# EAGLE design tomu-eagle0 (EAGLE 8.7.1)
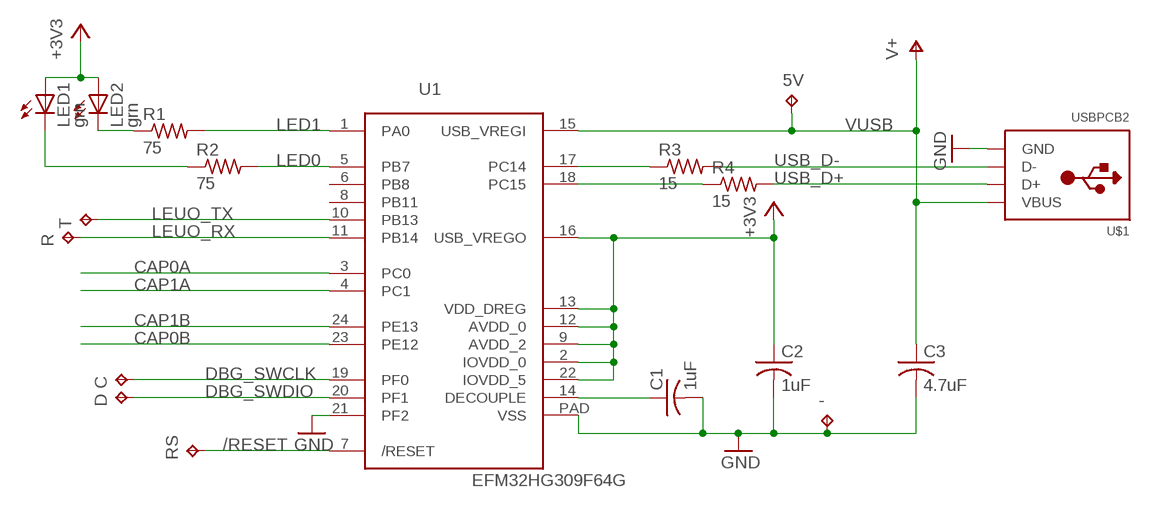
[diagram p0: schematic, sheet 1]

## Parts
5V  TPTP10R  [TP10R]
-  TPTP10SQ  [TP10SQ]
C  TPTP10R  [TP10R]
C1  1uF  C-USC0402K  [C0402K]
C2  1uF  C-USC0402K  [C0402K]
C3  4.7uF  C-USC0402K  [C0402K]
D  TPTP10R  [TP10R]
LED1  grn  LEDCHIP-LED0603  [CHIP-LED0603]
LED2  grn  LEDCHIP-LED0603  [CHIP-LED0603]
R  TPTP10R  [TP10R]
R1  75  R-US_R0402  [R0402]
R2  75  R-US_R0402  [R0402]
R3  15  R-US_R0402  [R0402]
R4  15  R-US_R0402  [R0402]
RS  TPTP10R  [TP10R]
T  TPTP10R  [TP10R]
U1  EFM32HG309F64G  [QFN24PAD]
U$1  USBPCB2  [USB-A-PCB-2]

## Nets
+3V3: C2.1 LED1.A LED2.A U1.2(IOVDD_0) U1.9(AVDD_2) U1.12(AVDD_0) U1.13(VDD_DREG) U1.16(USB_VREGO) U1.22(IOVDD_5)
/RESET: RS.TP U1.7(/RESET)
CAP0A: U1.3(PC0)
CAP0B: U1.23(PE12)
CAP1A: U1.4(PC1)
CAP1B: U1.24(PE13)
DBG_SWCLK: C.TP U1.19(PF0)
DBG_SWDIO: D.TP U1.20(PF1)
DECOUPLE: C1.1 U1.14(DECOUPLE)
GND: -.TP C1.2 C2.2 C3.2 U1.21(PF2) U1.PAD(VSS) U$1.GND
LED0: R2.2 U1.5(PB7)
LED1: R1.2 U1.1(PA0)
LEUO_RX: R.TP U1.11(PB14)
LEUO_TX: T.TP U1.10(PB13)
N$4: LED1.C R2.1
N$5: LED2.C R1.1
RUSB_D+: R4.1 U1.18(PC15)
RUSB_D-: R3.1 U1.17(PC14)
USB_D+: R4.2 U$1.USB_P(D+)
USB_D-: R3.2 U$1.USB_M(D-)
VUSB: 5V.TP C3.1 U1.15(USB_VREGI) U$1.5V(VBUS) ; supply symbol labelled V+
Unconnected: U1.6(PB8) U1.8(PB11)

## Library data of the parts
5V - C D R RS T = testpad:TP: Test pad
C1-C3 = adafruit:C-US: CAPACITOR, American symbol
LED1 LED2 = adafruit:LED: LED OSRAM: - CHIPLED LG R971, LG N971, LY N971, LG Q971, LY Q971, LO R971, LY R971 LH N974, LH R974 LS Q976, LO Q976, LY Q976 LO Q996 - Hyper CHIPLED LW Q18S LB Q993, LB Q99A, LB R99A - SideLED LS A670, LO A670, LY A670, LG A670, LP A670 LB A673, LV A673, LT A673, LW A673 LH A674 LY A675 LS A676, LA A676, LO A676, LY A676, LW A676 LS A679, LY A679, LG A679 - Hyper Micro SIDELED® LS Y876, LA Y876, LO Y876, LY Y876 LT Y87S - SmartLED LW L88C, LW L88S LB L89C, LB L89S, LG L890 LS L89K, LO L89K, LY L89K LS L896, LA L896, LO L896, LY L896 - TOPLED LS T670, LO T670, LY T670, LG T670, LP T670 LSG T670, LSP T670, LSY T670, LOP T670, LYG T670 LG T671, LOG T671, LSG T671 LB T673, LV T673, LT T673, LW T673 LH T674 LS T676, LA T676, LO T676, LY T676, LB T676, LH T676, LSB T676, LW T676 LB T67C, LV T67C, LT T67C, LS T67K, LO T67K, LY T67K, LW E67C LS E67B, LA E67B, LO E67B, LY E67B, LB E67C, LV E67C, LT E67C LW T67C LS T679, LY T679, LG T679 LS T770, LO T770, LY T770, LG T770, LP T770 LB T773, LV T773, LT T773, LW T773 LH T774 LS E675, LA E675, LY E675, LS T675 LS T776, LA T776, LO T776, LY T776, LB T776 LHGB T686 LT T68C, LB T68C - Hyper Mini TOPLED® LB M676 - Mini TOPLED Santana® LG M470 LS M47K, LO M47K, LY M47K Source: http://www.osram.convergy.de/
R1-R4 = adafruit:R-US_: RESISTOR, American symbol
U1 = todstuff:EFM32HG309F64G
U$1 = todstuff:USB

## Board
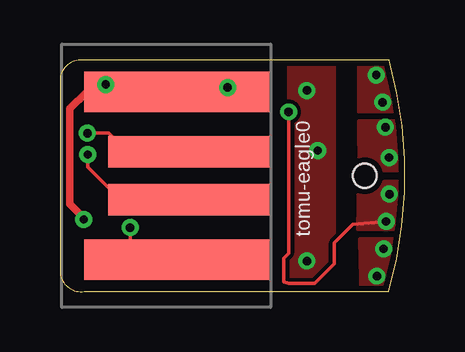
[diagram p1: board, top side]
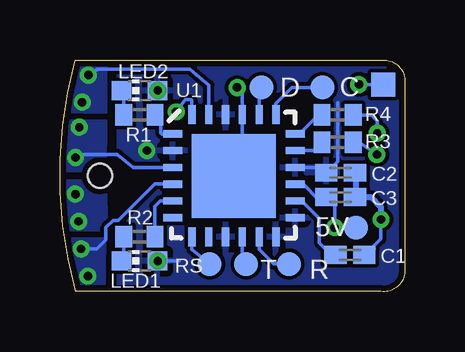
[diagram p2: board, bottom side, seen from below]

Size 14.36 x 9.67 mm. Coordinates in mm from the lower left corner, seen from the top.
Outline: 0,8.91 0,0.75 arc90 1,0.01 13.7,0.01 arc32 13.72,9.66 1,9.66 arc90 0,8.91
Copper layers (1*16): Top 0.0356mm / dielectric 1.5011mm / Bottom 0.0356mm
Design rules "LaenPCBOrderTodTent *": minimum track width 6mil, minimum drill 13mil, track to track 6mil, track to pad 6mil, pad to pad 6mil, via to via 6mil, smd to smd 6mil, copper to edge 10mil, drill to drill 6mil, minimum pad ring 7mil, minimum via ring 7mil, stop-mask expansion 3mil, vias tented up to drill 20mil, thermal gap 10mil
Holes 1 mm at 12.7,4.83

### Footprints (pad centres in the part's own frame; a part is rotated, then mirrored left to right if it is on the bottom)
TP10R = smd 1 x 1: TP 0,0
TP10SQ = smd 1 x 1: TP 0,0
C0402K = smd 0.925 x 0.74: 1 -0.6,0; 2 0.6,0
CHIP-LED0603 = smd 0.8 x 0.8: A 0,-0.75; C 0,0.75
R0402 = smd 0.7 x 0.9: 1 -0.65,0; 2 0.65,0
QFN24PAD = smd 0.8 x 0.3: 1 -2.55,1.75; 2 -2.55,1.05; 3 -2.55,0.35; 4 -2.55,-0.35; 5 -2.55,-1.05; 6 -2.55,-1.75; 13 2.55,-1.75; 14 2.55,-1.05; 15 2.55,-0.35; 16 2.55,0.35; 17 2.55,1.05; 18 2.55,1.75 | smd 0.3 x 0.8: 7 -1.75,-2.55; 8 -1.05,-2.55; 9 -0.35,-2.55; 10 0.35,-2.55; 11 1.05,-2.55; 12 1.75,-2.55; 19 1.75,2.55; 20 1.05,2.55; 21 0.35,2.55; 22 -0.35,2.55; 23 -1.05,2.55; 24 -1.75,2.55 | smd 3.5 x 3.5: PAD 0,0
USB-A-PCB-2 = smd 7.75 x 1.69: 5V -1.47,-3.5; GND -1.47,3.5 | smd 6.75 x 1.3: USB_M -0.97,-1; USB_P -0.97,1

### Placement (x,y rotation side)
5V  2.03,2.68 0 bottom
-  0.89,8.64 0 bottom
C  3.43,8.52 90 bottom
C1  2.29,1.53 0 bottom
C2  2.67,4.96 0 bottom
C3  2.67,3.95 0 bottom
D  5.97,8.52 90 bottom
LED1  11.05,1.28 90 bottom
LED2  11.05,8.39 90 bottom
R  4.83,1.15 0 bottom
R1  11.05,7.37 0 bottom
R2  11.05,2.29 0 bottom
R3  2.79,6.23 0 bottom
R4  2.79,7.37 0 bottom
RS  8.13,1.15 90 bottom
T  6.6,1.15 0 bottom
U1  7.11,4.83 0 bottom
U$1  6.35,4.83 0 top

### Tracks (layer width: path | path; a pad name or v marks a point on that pad's centre or on a via)
+3V3  (via drill 0.35)
  Top 0.152: 10.41,5.85 10.67,5.85
  Bottom 0.152: C2.1 3.35,4.88 3.65,5.18 U1.16 | C2.1 3.05,5.18 | LED2.A v10.29,8.39 | LED1.A v10.29,1.28 9.4,1.28 | C2.1 2.79,5.43 2.79,7.88
  other vias: 10.74,5.89
  pour Bottom: 11.94,10.42 11.94,-1.26 0,-1.26 0,10.42
  pour Top: 11.43,10.68 9.53,10.68 9.53,-1.26 11.43,-1.26
/RESET
  Bottom 0.152: U1.7 8.86,1.76 RS.TP
CAP0A  (via drill 0.35)
  Bottom 0.152: U1.3 11.3,5.18 11.97,5.72 13.59,5.72 v13.72,5.6
  other vias: 13.56,6.86
  pour Bottom: 12.45,7.12 14.48,7.12 14.5,5.05 12.47,5.05
  pour Top: 12.45,7.12 14.48,7.12 14.5,5.05 12.47,5.05
CAP0B  (via drill 0.35)
  Bottom 0.152: v13.18,9.04 12.8,9.28 8.95,9.28 8.16,8.62 U1.23
  other vias: 13.44,7.9
  pour Bottom: 12.45,10.42 12.45,7.48 14.22,7.51 13.76,10.42
  pour Top: 12.45,10.42 12.45,7.5 14.22,7.51 13.76,10.42
CAP1A  (via drill 0.35)
  Bottom 0.152: U1.4 10.41,4.48 11.93,2.97 12.14,2.97 12.45,2.67 12.45,2.17 12.83,1.79 v13.48,1.79
  other vias: 13.2,0.65
  pour Bottom: 12.49,2.21 14.26,2.2 13.68,-0.33 12.55,-0.32
  pour Top: 12.49,2.21 14.27,2.23 13.69,-0.31 12.55,-0.32
CAP1B  (via drill 0.35)
  Top 0.152: v9.53,7.5 9.53,1.59 9.32,1.39 9.32,0.41 9.53,0.34 10.62,0.34 11.43,1.15 11.43,2.04 12.19,2.8 v13.59,2.93
  Bottom 0.152: 8.9,7.37 U1.24 8.86,7.98 8.89,8.01 9.14,8.01 9.21,7.93 v9.53,7.5
  other vias: 13.72,4.07
  pour Bottom: 12.48,4.62 14.5,4.61 14.3,2.59 12.4,2.59
  pour Top: 12.45,4.58 14.5,4.61 14.3,2.59 12.4,2.59
DBG_SWCLK
  Bottom 0.152: 5.36,7.73 U1.19 5.36,7.85 4.7,8.52 C.TP
DBG_SWDIO
  Bottom 0.152: 6.06,8.64 D.TP 6.06,8.42 U1.20
DECOUPLE
  Bottom 0.152: 2.89,1.62 C1.1 3.05,1.53 3.56,2.04 3.56,3.06 4.28,3.78 U1.14
GND  (via drill 0.35)
  Top 0.152: U$1.GND 6.86,8.33 v6.99,8.52 | 4.43,8.14 U$1.GND | U$1.GND 4.45,8.33 2.09,8.33 v1.91,8.64
  Top 0.254: 1.21,8.33 4.45,8.33 | 0.99,3.21 v0.99,3.01
  Top 0.305: v0.99,3.01 0.99,3.08 0.41,3.67 0.41,7.63 1.11,8.33 1.21,8.33
  Bottom 0.152: 6.83,4.83 U1.PAD 6.76,5.18 U1.21 6.76,8.42 v6.99,8.52 | v1.91,8.64 -.TP | C1.2 1.65,1.53 | 1.65,1.53 1.52,1.53 1.27,1.79 | v0.99,3.01 0.99,2.2 1.65,1.53
  Bottom 0.254: C3.2 2.03,3.95 | 2.03,3.95 1.4,3.95 0.99,3.54 v0.99,3.01 | C2.2 2.03,4.93 2.03,3.95
LED0
  Bottom 0.152: U1.5 10.19,3.78 10.41,3.56 10.41,2.04 R2.2
LED1
  Bottom 0.152: U1.1 10.13,6.58 10.16,6.61 10.16,7.23 R1.2
LEUO_RX
  Bottom 0.152: U1.11 6.06,1.75 5.46,1.15 R.TP
LEUO_TX
  Bottom 0.152: U1.10 6.76,1.18 T.TP
N$4
  Bottom 0.152: 11.67,2.27 R2.1 11.7,1.38 LED1.C
N$5
  Bottom 0.152: LED2.C 11.7,8.29 R1.1
RUSB_D+
  Bottom 0.152: 4.62,6.56 U1.18 4.39,6.58 3.66,7.31 | 3.56,7.12 3.62,7.23 3.66,7.31 | 3.66,7.31 R4.1
RUSB_D-
  Bottom 0.152: U1.17 3.79,5.88 R3.1
USB_D+  (via drill 0.35)
  Top 0.152: v1.14,6.61 2.03,6.61 2.81,5.83 U$1.USB_P
  Bottom 0.152: R4.2 1.4,7.37 1.14,7.12 v1.14,6.61
USB_D-  (via drill 0.35)
  Top 0.152: U$1.USB_M 5.36,3.82 4.86,4.33 2.03,4.33 1.16,5.2 v1.16,5.72
  Bottom 0.152: v1.16,5.72 1.92,6.23 R3.2
VUSB  (via drill 0.35)
  Top 0.152: U$1.5V 3.36,1.33 2.92,1.41 v2.92,2.68
  Bottom 0.152: C3.1 3.3,3.73 | C3.1 3.23,3.85 3.59,3.85 4.22,4.48 U1.15 | C3.1 2.92,3.6 v2.92,2.68 5V.TP

### Text on the board
tPlace: tomu-eagle0